# Altium schematic sheet MODULE WIFI LAMP CONTROL.SchDoc
size A4
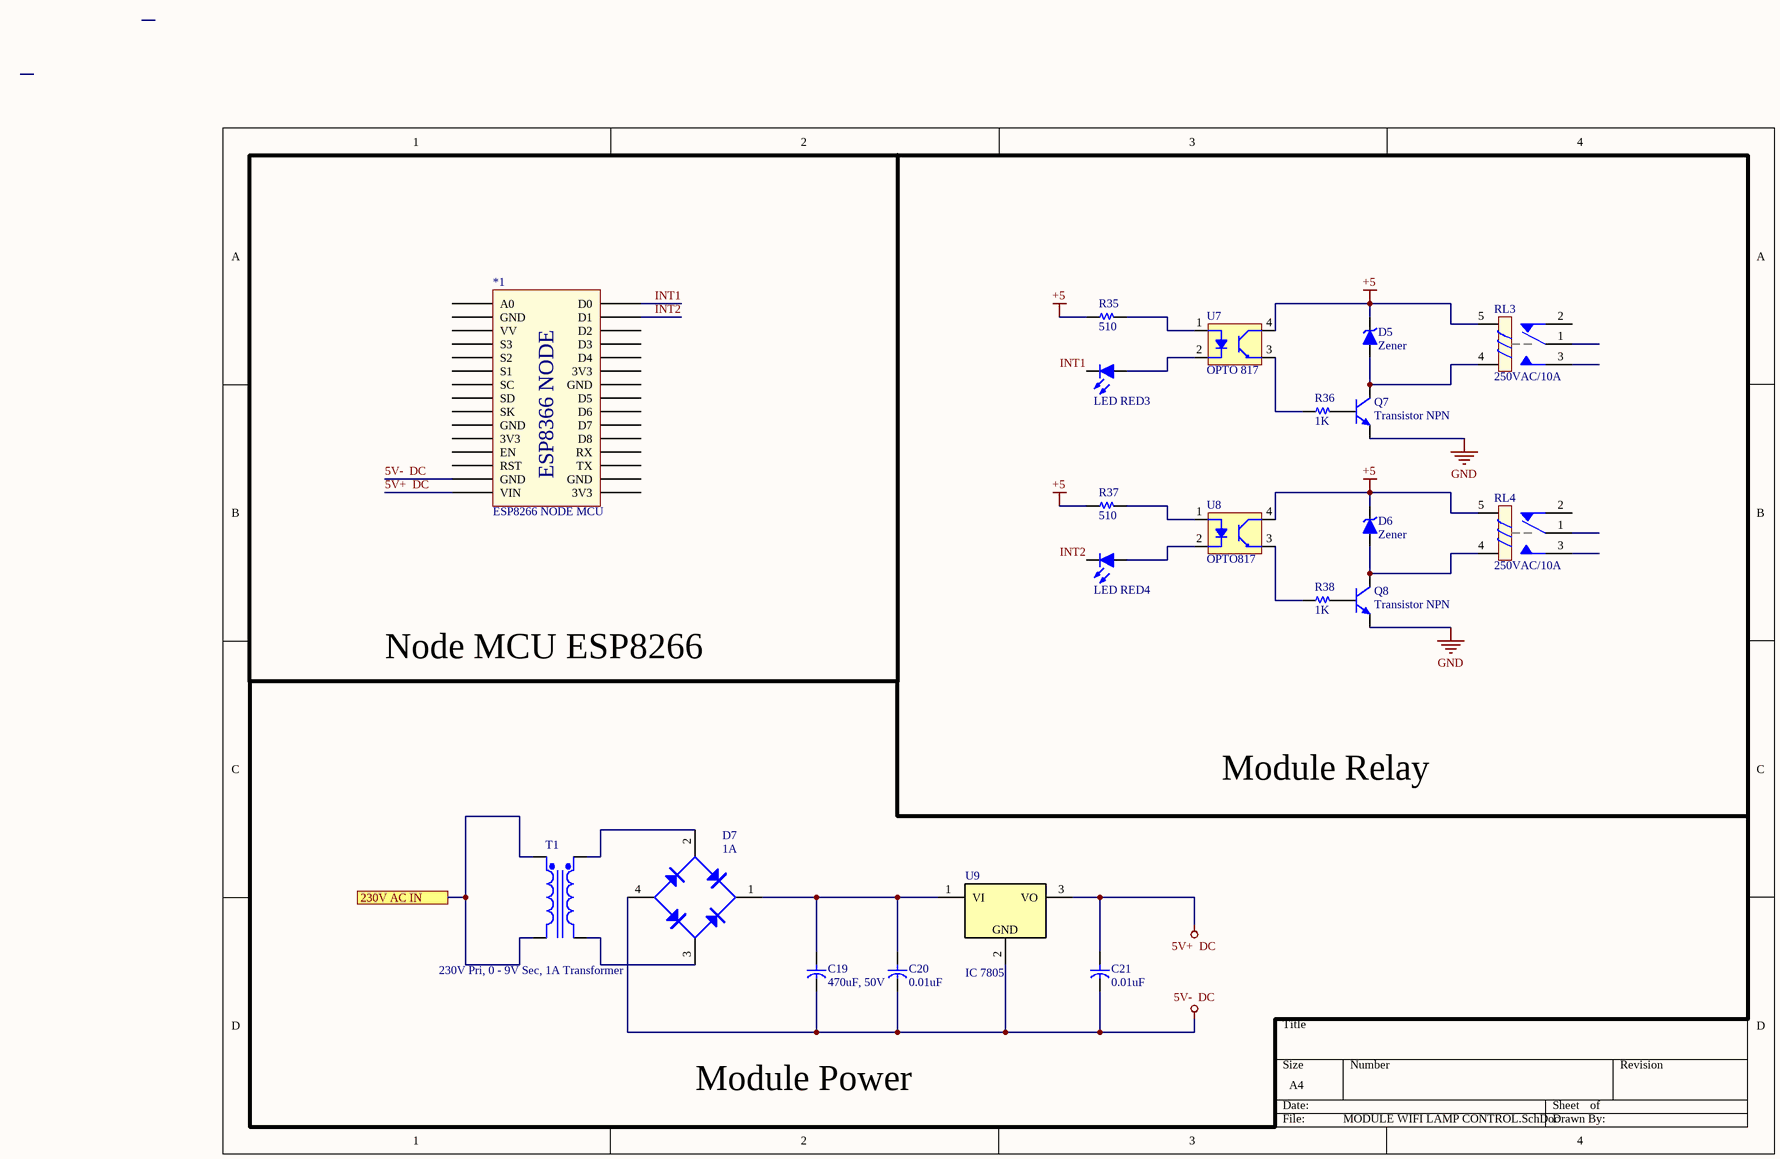
[diagram p0: MODULE WIFI LAMP CONTROL.SchDoc]

## Parts
*1  ESP8266 NODE MCU  [ESP8266 NODE MCU]
C19  470uF, 50V  [CYL/D.500/LS.200]
C20  0.01uF  [CYL/D.500/LS.200]
C21  0.01uF  [CYL/D.500/LS.200]
D5  Zener  [DO-41]
D6  Zener  [DO-41]
D7  1A  [BRIDGE_DAN]
LED_RED3  LED RED  [LED 5MM - RED]  (value not drawn)
LED_RED4  LED RED  [LED 5MM - RED]  (value not drawn)
Q7  Transistor NPN  [SOT-23]
Q8  Transistor NPN  [SOT-23]
R35  510  [R 1/4W/300]
R36  1K  [R 1/4W/300]
R37  510  [R 1/4W/300]
R38  1K  [R 1/4W/300]
RL3  250VAC/10A  [Relay 5 Chan SRD]
RL4  250VAC/10A  [Relay 5 Chan SRD]
T1  230V Pri, 0 - 9V Sec, 1A Transformer  [TRF_4]
U7  OPTO 817  [DIP4 - PC817]
U8  OPTO817  [DIP4 - PC817]
U9  IC 7805  [DPAK_118_446_112X59_SMD]

## Ports
230V AC IN

## Nets
5V+  DC: *1.15(VIN) C21.1 U9.3(VO)
5V-  DC: *1.14(GND) C19.2 C20.2 C21.2 D7.4(V-) U9.2
+5: D5.2(K) D6.2(K) R35.1 R37.1 RL3.5 RL4.5 U7.4(C) U8.4(C)
GND: Q7.2(E) Q8.2(E)
230V AC IN: T1.1(Pri+) T1.2(Pri-) ; port 230V AC IN
INT1: *1.30(D0)
INT2: *1.29(D1)
NetC19_1: C19.1 C20.1 D7.1(V+) U9.1(VI)
NetD5_1: D5.1(A) Q7.3(C) RL3.4
NetD6_1: D6.1(A) Q8.3(C) RL4.4
NetD7_2: D7.2(AC) T1.3(Sec+)
NetD7_3: D7.3(AC) T1.4(Sec-)
NetLED_RED3_1: LED_RED3.1(A) U7.2(K)
NetLED_RED4_1: LED_RED4.1(A) U8.2(K)
NetQ7_1: Q7.1(B) R36.2
NetQ8_1: Q8.1(B) R38.2
NetR35_2: R35.2 U7.1(A)
NetR36_1: R36.1 U7.3(E)
NetR37_2: R37.2 U8.1(A)
NetR38_1: R38.1 U8.3(E)

Not connected (* = marked no-connect by the designer): *1 1(A0) 2(GND) 3(VV) 4(S3) 5(S2) 6(S1) 7(SC) 8(SD) 9(SK) 10(GND) 11(3V3) 12(EN) 13(RST) 16(3V3) 17(GND) 18(TX) 19(RX) 20(D8) 21(D7) 22(D6) 23(D5) 24(GND) 25(3V3) 26(D4) 27(D3) 28(D2); LED_RED3 2(K); LED_RED4 2(K); RL3 1 2 3; RL4 1 2 3

## Notes on the sheet
- Node MCU ESP8266
- Module Relay
- Module Power
- Labels drawn without touching a wire or pin: INT1, INT2
- (in symbol ESP8266 NODE MCU) ESP8366 NODE
- (in symbol REG_35V_5V-1.5A-7.5W-DPAK) GND

## Library data of the parts
C19-C21 = Capacitor: Capacitor pol
D5 D6 = Diode Zener: Zener Diode
D7 = BRIDGE1: Diode Bridge
LED_RED3 LED_RED4 = Led: Typical LED
Q7 Q8 = Transistor NPN: NPN Bipolar Transistor
R35-R38 = Resistor
RL3 RL4 = Relay 5 Chan SRD: Relay 5 Chan; Ma_Hang: MH009374; Ten: Relay 5V10A SRD-05VDC-SL-C Chính Hãng
T1 = Trans Cupl: Transformer (Coupled Inductor Model); Published: 8-Jun-2000; LatestRevisionDate: 17-Jul-2002; LatestRevisionNote: Re-released for DXP Platform.; PackageReference: TRF_4; Publisher: Altium Limited; PackageDescription: Transformer; 4 Leads
U7 U8 = PC817: Opto PC817B
U9 = REG_35V_5V-1.5A-7.5W-DPAK: Linear Voltage Regulator IC 1 Output 1.5A DPAK; Manufacturer: Diodes; Manufacturer Part Number: L7805CDT-TR; Alternate Part Number-1: CJ7805 3%; Case/Package: DPAK; Supplier-1: SP ROAD; Supplier Part Number-1: L7805CDT-TR